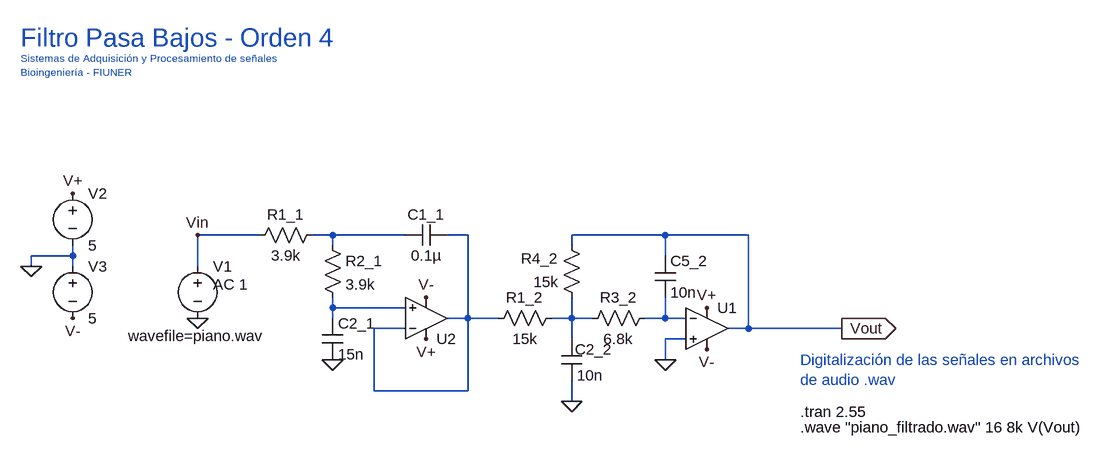
[diagram p0: schematic Analisis_Temporal_PasaBajos.asc]
Analisis_Temporal_PasaBajos.asc, the LTspice schematic file:
Version 4
SHEET 1 1376 680
WIRE 48 176 -48 176
WIRE 160 176 128 176
WIRE 272 176 160 176
WIRE 368 176 336 176
WIRE 672 176 528 176
WIRE 800 176 672 176
WIRE 160 192 160 176
WIRE 528 192 528 176
WIRE -240 208 -240 192
WIRE -240 208 -304 208
WIRE 672 208 672 176
WIRE -304 224 -304 208
WIRE -240 224 -240 208
WIRE -48 224 -48 176
WIRE 160 288 160 272
WIRE 272 288 160 288
WIRE 160 304 160 288
WIRE 368 304 368 176
WIRE 368 304 336 304
WIRE 416 304 368 304
WIRE 528 304 528 272
WIRE 528 304 496 304
WIRE 560 304 528 304
WIRE 672 304 672 272
WIRE 672 304 640 304
WIRE 704 304 672 304
WIRE 272 320 224 320
WIRE 800 320 800 176
WIRE 800 320 768 320
WIRE 944 320 800 320
WIRE 528 336 528 304
WIRE 704 336 672 336
WIRE 672 368 672 336
WIRE 224 416 224 320
WIRE 368 416 368 304
WIRE 368 416 224 416
WIRE 528 432 528 400
FLAG 736 288 V+
FLAG 736 352 V-
FLAG -48 304 0
FLAG -304 224 0
FLAG -240 304 V-
FLAG -240 112 V+
FLAG 944 320 Vout
IOPIN 944 320 Out
FLAG 672 368 0
FLAG 528 432 0
FLAG 304 336 V+
FLAG 304 272 V-
FLAG 160 368 0
FLAG -48 176 Vin
SYMBOL Opamps\\UniversalOpamp2 736 320 R0
SYMATTR InstName U1
SYMBOL voltage -48 208 R0
WINDOW 123 24 44 Left 2
WINDOW 3 -107 123 Left 2
SYMATTR Value2 AC 1
SYMATTR Value wavefile=piano.wav
SYMATTR InstName V1
SYMBOL voltage -240 96 R0
WINDOW 123 0 0 Left 2
WINDOW 39 0 0 Left 2
SYMATTR InstName V2
SYMATTR Value 5
SYMBOL voltage -240 208 R0
WINDOW 123 0 0 Left 2
WINDOW 39 0 0 Left 2
SYMATTR InstName V3
SYMATTR Value 5
SYMBOL cap 656 208 R0
SYMATTR InstName C5_2
SYMATTR Value 10n
SYMBOL res 656 288 R90
WINDOW 0 0 56 VBottom 2
WINDOW 3 32 56 VTop 2
SYMATTR InstName R3_2
SYMATTR Value 6.8k
SYMBOL res 512 288 R90
WINDOW 0 0 56 VBottom 2
WINDOW 3 32 56 VTop 2
SYMATTR InstName R1_2
SYMATTR Value 15k
SYMBOL cap 512 336 R0
WINDOW 0 21 16 Left 2
SYMATTR InstName C2_2
SYMATTR Value 10n
SYMBOL res 544 288 R180
WINDOW 0 36 76 Left 2
WINDOW 3 36 40 Left 2
SYMATTR InstName R4_2
SYMATTR Value 15k
SYMBOL Opamps\\UniversalOpamp2 304 304 M180
SYMATTR InstName U2
SYMBOL res 144 176 R0
SYMATTR InstName R2_1
SYMATTR Value 3.9k
SYMBOL cap 336 160 R90
WINDOW 0 0 32 VBottom 2
WINDOW 3 32 32 VTop 2
SYMATTR InstName C1_1
SYMATTR Value 0.1µ
SYMBOL cap 144 304 R0
SYMATTR InstName C2_1
SYMATTR Value 15n
SYMBOL res 144 160 R90
WINDOW 0 0 56 VBottom 2
WINDOW 3 32 56 VTop 2
SYMATTR InstName R1_1
SYMATTR Value 3.9k
TEXT 880 448 Left 2 !.tran 2.55
TEXT -320 -128 Left 4 ;Filtro Pasa Bajos - Orden 4
TEXT -320 -96 Left 1 ;Sistemas de Adquisición y Procesamiento de señales\nBioingeniería - FIUNER
TEXT 880 472 Left 2 !.wave "piano_filtrado.wav" 16 8k V(Vout)
TEXT 880 368 Left 2 ;Digitalización de las señales en archivos \nde audio .wav

The netlist it stands for:
* Analisis_Temporal_PasaBajos.asc
XU1 0 N005 V+ V- Vout level.2 Avol=1Meg GBW=10Meg Slew=10Meg ilimit=25m rail=0 Vos=0 phimargin=45 en=0 enk=0 in=0 ink=0 Rin=500Meg  ; pins IN+ IN- V+ V- OUT
V1 Vin 0 wavefile=piano.wav AC 1
V2 V+ 0 5
V3 0 V- 5
C5_2 Vout N005 10n
R3_2 N005 N004 6.8k
R1_2 N004 N002 15k
C2_2 N004 0 10n
R4_2 N004 Vout 15k
XU2 N003 N002 V+ V- N002 level.2 Avol=1Meg GBW=10Meg Slew=10Meg ilimit=25m rail=0 Vos=0 phimargin=45 en=0 enk=0 in=0 ink=0 Rin=500Meg  ; pins IN+ IN- V+ V- OUT
R2_1 N001 N003 3.9k
C1_1 N002 N001 0.1µ
C2_1 N003 0 15n
R1_1 N001 Vin 3.9k
.tran 2.55
* Filtro Pasa Bajos - Orden 4
* Sistemas de Adquisición y Procesamiento de señales
* Bioingeniería - FIUNER
.wave "piano_filtrado.wav" 16 8k V(Vout)
* Digitalización de las señales en archivos
* de audio .wav
.lib UniversalOpamps2.sub
.backanno
.end